# EAGLE design omni-ultra-l2 (EAGLE 9.1.3)
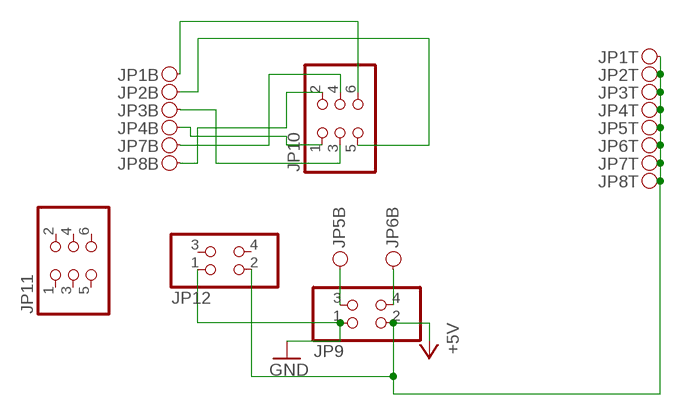
[diagram p0: schematic, sheet 1]

## Parts
JP1  PINH2X01  [PINH2X01SMD]
JP2  PINH2X01  [PINH2X01SMD]
JP3  PINH2X01  [PINH2X01SMD]
JP4  PINH2X01  [PINH2X01SMD]
JP5  PINH2X01  [PINH2X01SMD]
JP6  PINH2X01  [PINH2X01SMD]
JP7  PINH2X01  [PINH2X01SMD]
JP8  PINH2X01  [PINH2X01SMD]
JP9  PINHD-2X2  [2X02]
JP10  PINHD-2X3  [2X03]
JP11  PINHD-2X3  [2X03]
JP12  PINHD-2X2  [2X02]

## Nets
+5V: JP1.T1 JP2.T1 JP3.T1 JP4.T1 JP5.T1 JP6.T1 JP7.T1 JP8.T1 JP9.2 JP12.2
GND: JP9.1 JP12.1
N$1: JP1.B1 JP10.6
N$2: JP2.B1 JP10.5
N$4: JP3.B1 JP10.3
N$5: JP8.B1 JP10.2
N$6: JP7.B1 JP10.4
N$7: JP5.B1 JP9.3
N$8: JP6.B1 JP9.4
N$9: JP4.B1 JP10.1
Unconnected: JP11.1 JP11.2 JP11.3 JP11.4 JP11.5 JP11.6 JP12.3 JP12.4

## Library data of the parts
JP1-JP8 = pinhead_smd:PINH2X01
JP9 JP12 = pinhead:PINHD-2X2: PIN HEADER
JP10 JP11 = pinhead:PINHD-2X3: PIN HEADER

## Board
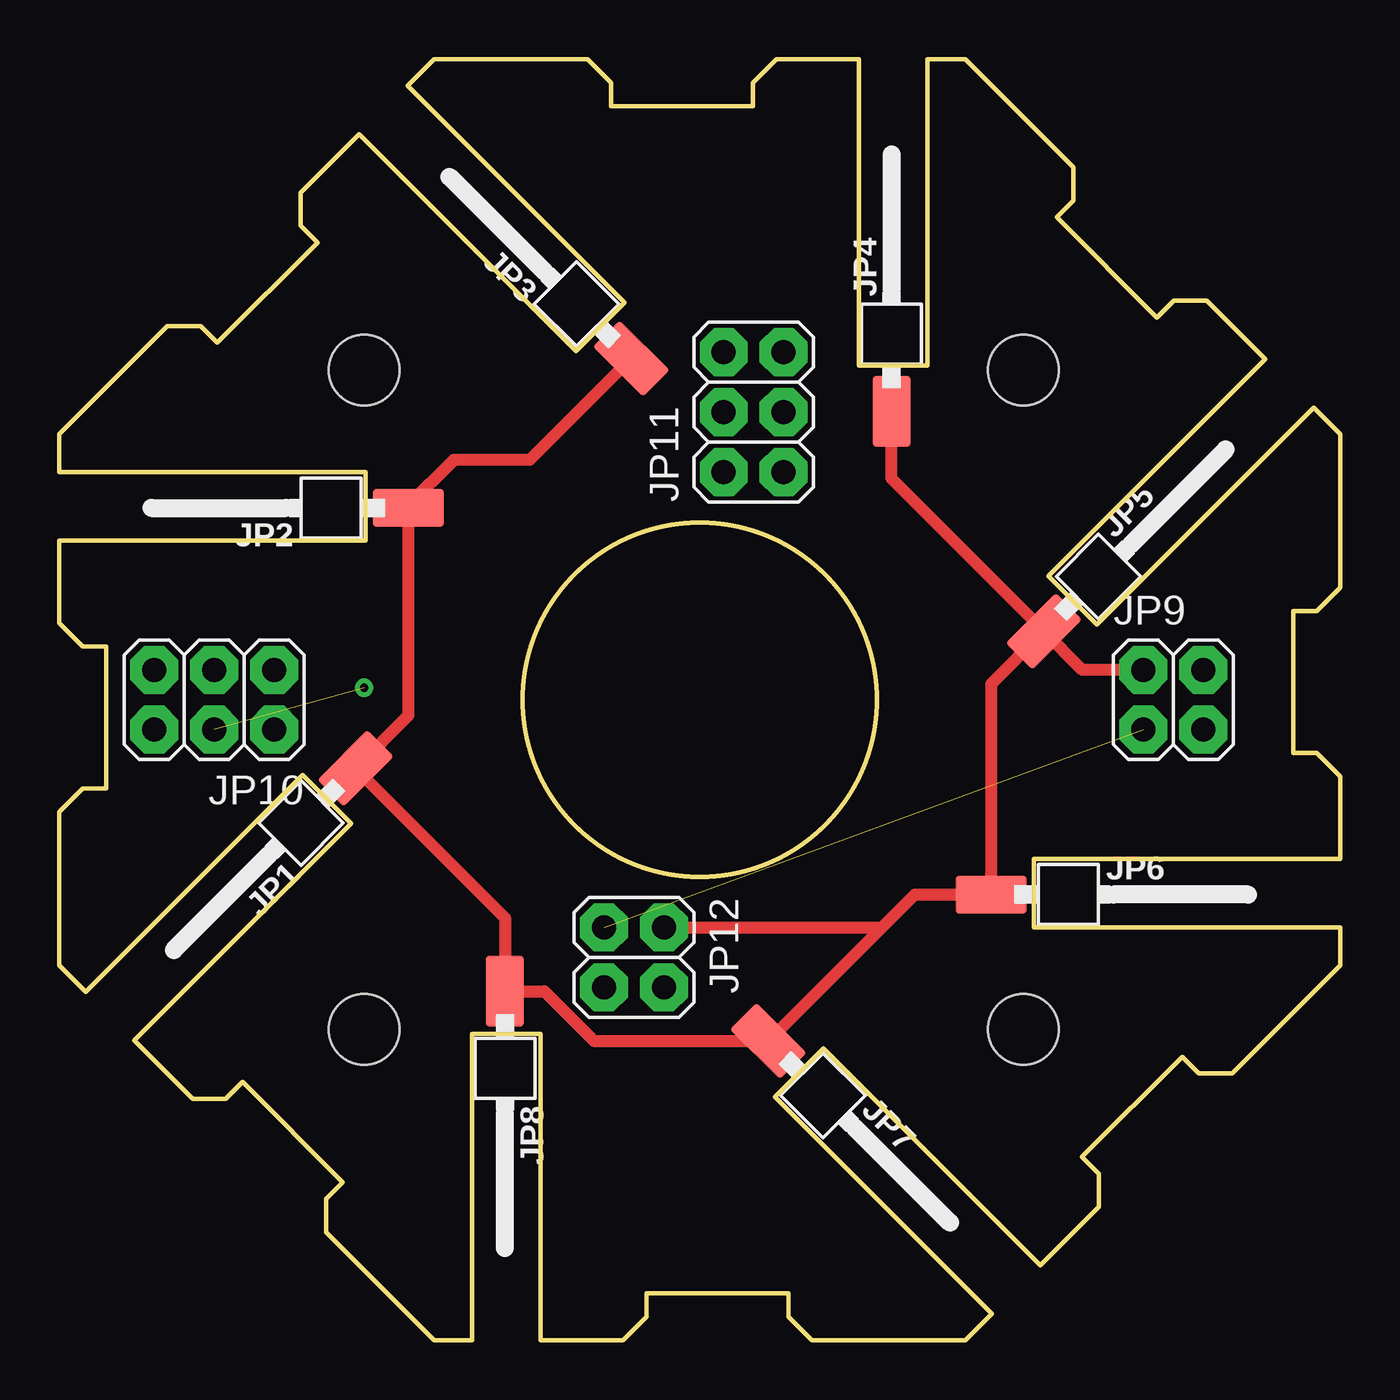
[diagram p1: board, top side]
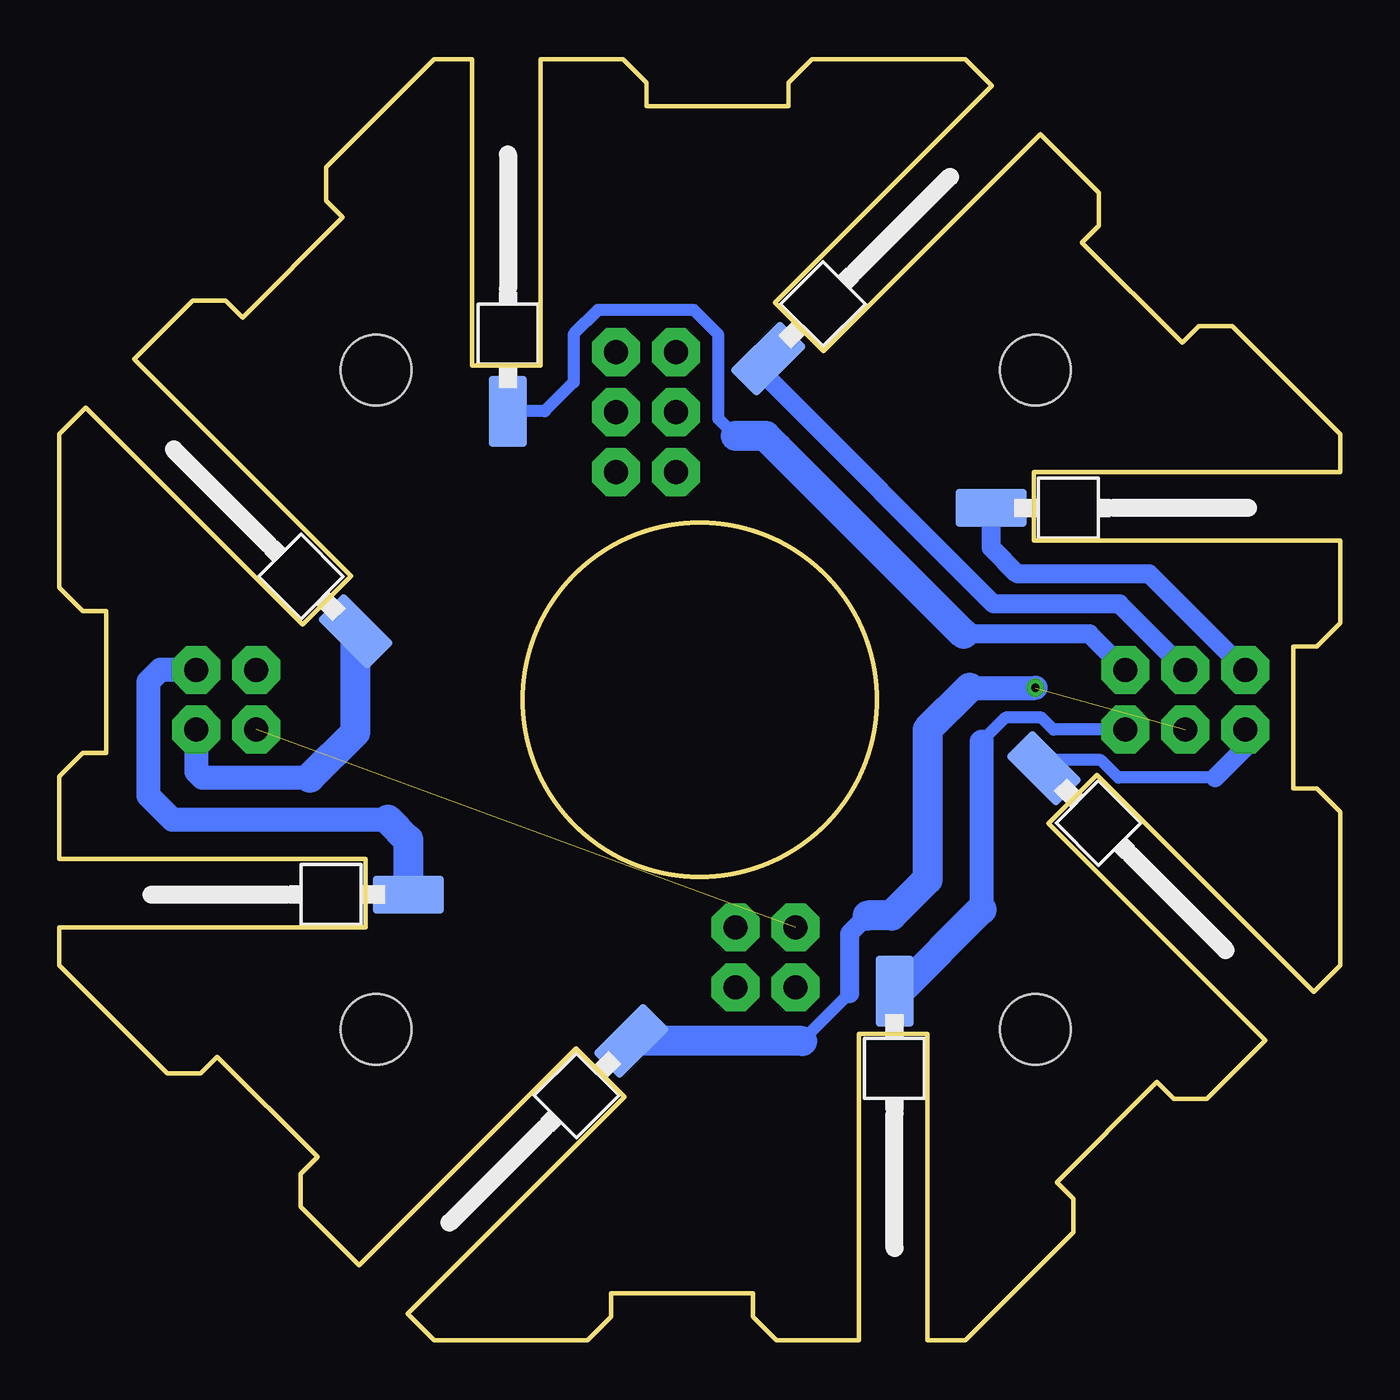
[diagram p2: board, bottom side, seen from below]

Size 54.3 x 54.3 mm. Coordinates in mm from the lower left corner, seen from the top.
Outline: 12.02,6.71 11.31,6 11.31,4.59 15.9,0 17.5,0 17.5,13 20.4,13 20.4,0 23.9,0 24.9,1 24.9,2 30.9,2 30.9,1 31.9,0 38.4,0 39.53,1.13 30.34,10.32 32.38,12.37 41.58,3.18 44.05,5.66 44.05,7.07 43.35,7.78 47.59,12.02 48.3,11.31 49.71,11.31 54.3,15.9 54.3,17.5 41.3,17.5 41.3,20.4 54.3,20.4 54.3,23.9 53.3,24.9 52.3,24.9 52.3,30.9 53.3,30.9 54.3,31.9 54.3,38.4 53.17,39.53 43.98,30.33 41.93,32.38 51.12,41.58 48.64,44.05 47.23,44.05 46.52,43.35 42.28,47.59 42.99,48.3 42.99,49.71 38.4,54.3 36.8,54.3 36.8,41.3 33.9,41.3 33.9,54.3 30.4,54.3 29.4,53.3 29.4,52.3 23.4,52.3 23.4,53.3 22.4,54.3 15.9,54.3 14.77,53.17 23.96,43.98 21.91,41.93 12.72,51.12 10.25,48.64 10.25,47.23 10.95,46.52 6.71,42.28 6.01,42.99 4.59,42.99 0,38.4 0,36.8 13,36.8 13,33.9 0,33.9 0,30.4 1,29.4 2,29.4 2,23.4 1,23.4 0,22.4 0,15.9 1.13,14.77 10.32,23.96 12.37,21.91 3.18,12.72 5.66,10.25 7.07,10.25 7.78,10.95 12.02,6.71
Outline: circle at 27.15,27.15 radius 7.5
Copper layers (1*16): Top 0.035mm / dielectric 1.5mm / Bottom 0.035mm
Design rules "rucni": minimum track width 10mil, minimum drill 0.8mm, track to track 10mil, track to pad 10mil, pad to pad 10mil, via to via 10mil, smd to smd 10mil, copper to edge 40mil, drill to drill 10mil, minimum pad ring 10mil, minimum via ring 8mil, stop-mask expansion 4mil, vias tented up to drill 0mil, thermal gap 10mil
Holes 3 mm at 12.93,41.12 40.87,41.12 40.87,13.18 12.93,13.18

### Footprints (pad centres in the part's own frame; a part is rotated, then mirrored left to right if it is on the bottom)
PINH2X01SMD = smd 1.6 x 3 bottom: B1 0,-2 | smd 1.6 x 3: T1 0,-2
2X02 = drill 1.016 octagon: 1 -1.27,-1.27; 2 -1.27,1.27; 3 1.27,-1.27; 4 1.27,1.27
2X03 = drill 1.016 octagon: 1 -2.54,-1.27; 2 -2.54,1.27; 3 0,-1.27; 4 0,1.27; 5 2.54,-1.27; 6 2.54,1.27

### Placement (x,y rotation side)
JP1  11.15,22.83 135 top
JP2  12.8,35.28 90 top
JP3  22.83,43.02 45 top
JP4  35.28,41.37 0 top
JP5  43.15,31.47 315 top
JP6  41.5,18.89 270 top
JP7  31.47,11.27 225 top
JP8  18.9,12.8 180 top
JP9  47.22,27.15 0 top
JP10  6.58,27.15 180 top
JP11  29.44,39.34 90 top
JP12  24.36,16.23 270 top

### Tracks (layer width: path | path; a pad name or v marks a point on that pad's centre or on a via)
+5V
  Top 0.508: 34.86,17.5 JP7.T1 22.68,12.69 20.57,14.8 JP8.T1 18.9,17.91 JP1.T1 14.8,26.48 JP2.T1 14.8,35.37 16.74,37.31 19.95,37.31 JP3.T1 | JP5.T1 39.5,27.82 JP6.T1 36.26,18.89 34.86,17.5 | JP5.T1 35.28,36.51 JP4.T1 | JP9.2 43.37,28.42 JP5.T1 | 34.86,17.5 34.56,17.5 JP12.2
GND  (1 unrouted)
N$1
  Bottom 0.508: 5.31,23.85 9.41,23.85 10.16,24.6 12.21,24.6 JP1.B1
  Bottom 0.813: 5.31,23.85 4.04,25.12 JP10.6
N$2
  Bottom 0.813: JP10.5 8.1,32.48 13.69,32.48 14.8,33.59 JP2.B1
N$4
  Bottom 0.508: 24.25,40.76 JP3.B1
  Bottom 0.813: JP10.3 9.37,31.21 14.7,31.21 24.25,40.76
N$5
  Bottom 0.508: 18.67,14.8 JP8.B1 | JP10.2 12.16,25.88 12.67,26.39 14.2,26.39 15.21,25.37
  Bottom 1.016: 15.21,25.37 15.21,18.26
  Bottom 1.27: 15.21,18.26 18.67,14.8
N$6  (via drill 0.35)  (1 unrouted)
  Bottom 0.508: 20.8,14.7 22.82,12.69
  Bottom 0.813: 20.04,18.01 20.8,17.24 20.8,14.7
  Bottom 1.016: 15.72,27.66 v12.93,27.66
  Bottom 1.27: 15.72,27.66 17.5,25.88 17.5,19.53 19.02,18.01 20.04,18.01 | 22.82,12.69 JP7.B1
N$7
  Bottom 1.016: JP9.3 48.49,24.1 48.23,23.85 43.66,23.85
  Bottom 1.27: 43.66,23.85 41.74,25.77 JP5.B1
N$8
  Bottom 1.016: JP9.4 50.01,28.42 50.52,27.91 50.52,23.09 49.5,22.07 40.36,22.07
  Bottom 1.27: JP6.B1 39.5,21.21 40.36,22.07
N$9
  Bottom 0.508: JP4.B1 33.72,39.37 32.49,40.6 32.49,42.63 31.47,43.66 27.4,43.66 26.36,42.62 26.36,40.33 26.36,39.06 25.63,38.33
  Bottom 0.813: JP10.1 10.64,29.94 15.97,29.94
  Bottom 1.27: 15.97,29.94 23.85,37.82 24.36,38.33 25.63,38.33